# EAGLE schematic quick_mock (EAGLE 9.6.2)
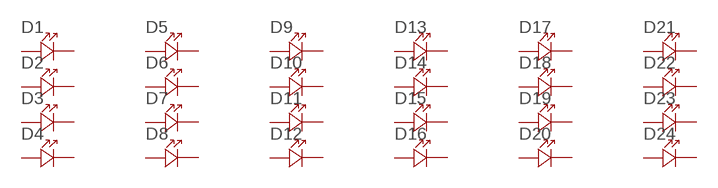
[diagram p0: schematic, sheet 1]

## Parts
D1  LED-603  [SMD-603]
D2  LED-603  [SMD-603]
D3  LED-603  [SMD-603]
D4  LED-603  [SMD-603]
D5  LED-603  [SMD-603]
D6  LED-603  [SMD-603]
D7  LED-603  [SMD-603]
D8  LED-603  [SMD-603]
D9  LED-603  [SMD-603]
D10  LED-603  [SMD-603]
D11  LED-603  [SMD-603]
D12  LED-603  [SMD-603]
D13  LED-603  [SMD-603]
D14  LED-603  [SMD-603]
D15  LED-603  [SMD-603]
D16  LED-603  [SMD-603]
D17  LED-603  [SMD-603]
D18  LED-603  [SMD-603]
D19  LED-603  [SMD-603]
D20  LED-603  [SMD-603]
D21  LED-603  [SMD-603]
D22  LED-603  [SMD-603]
D23  LED-603  [SMD-603]
D24  LED-603  [SMD-603]
Unconnected: D1.P$1(ANODE+) D1.P$2(CATHODE-) D2.P$1(ANODE+) D2.P$2(CATHODE-) D3.P$1(ANODE+) D3.P$2(CATHODE-) D4.P$1(ANODE+) D4.P$2(CATHODE-) D5.P$1(ANODE+) D5.P$2(CATHODE-) D6.P$1(ANODE+) D6.P$2(CATHODE-) D7.P$1(ANODE+) D7.P$2(CATHODE-) D8.P$1(ANODE+) D8.P$2(CATHODE-) D9.P$1(ANODE+) D9.P$2(CATHODE-) D10.P$1(ANODE+) D10.P$2(CATHODE-) D11.P$1(ANODE+) D11.P$2(CATHODE-) D12.P$1(ANODE+) D12.P$2(CATHODE-) D13.P$1(ANODE+) D13.P$2(CATHODE-) D14.P$1(ANODE+) D14.P$2(CATHODE-) D15.P$1(ANODE+) D15.P$2(CATHODE-) D16.P$1(ANODE+) D16.P$2(CATHODE-) D17.P$1(ANODE+) D17.P$2(CATHODE-) D18.P$1(ANODE+) D18.P$2(CATHODE-) D19.P$1(ANODE+) D19.P$2(CATHODE-) D20.P$1(ANODE+) D20.P$2(CATHODE-) D21.P$1(ANODE+) D21.P$2(CATHODE-) D22.P$1(ANODE+) D22.P$2(CATHODE-) D23.P$1(ANODE+) D23.P$2(CATHODE-) D24.P$1(ANODE+) D24.P$2(CATHODE-)

## Library data of the parts
D1-D24 = Rob-Diodes:LED